# EAGLE schematic test1 (EAGLE 9.2.0)
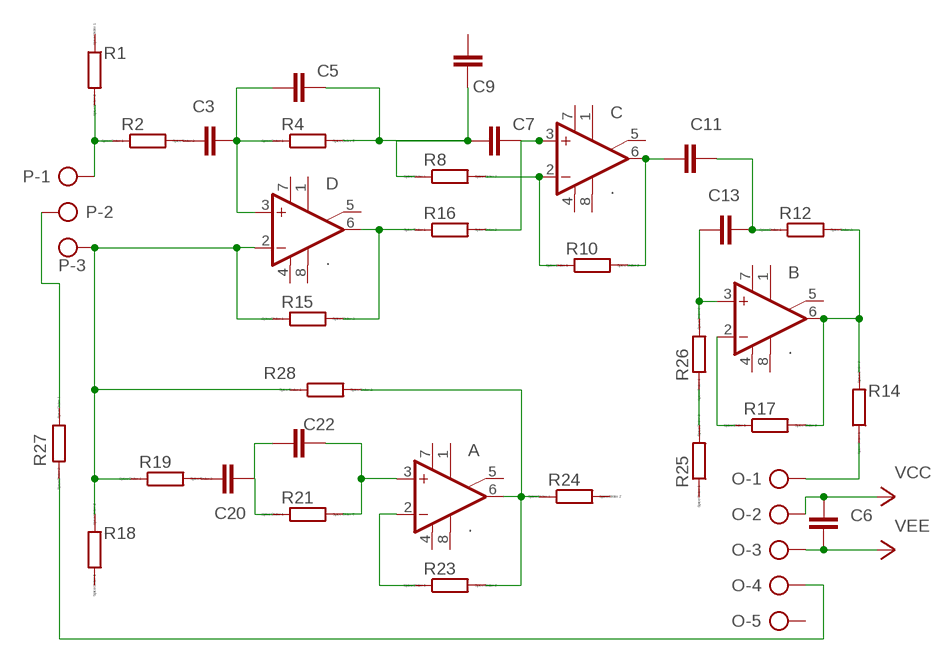
[diagram p0: schematic, sheet 1]

## Parts
A  .  TL071D  [SO08]
B  .  TL071D  [SO08]
C  .  TL071D  [SO08]
C3  C-EUC1210  [C1210]
C5  C-EUC1210  [C1210]
C6  C-EUC1210  [C1210]
C7  C-EUC1210  [C1210]
C9  C-EUC1210  [C1210]
C11  C-EUC1210  [C1210]
C13  C-EUC1210  [C1210]
C20  C-EUC1210  [C1210]
C22  C-EUC1210  [C1210]
D  .  TL071D  [SO08]
O  AK500/5-H  [AK500/5-H]
P  AK500/3-H  [AK500/3-H]
R1  RR1206  [R1206]
R2  RR1206  [R1206]
R4  RR1206  [R1206]
R8  RR1206  [R1206]
R10  RR1206  [R1206]
R12  RR1206  [R1206]
R14  RR1206  [R1206]
R15  RR1206  [R1206]
R16  RR1206  [R1206]
R17  RR1206  [R1206]
R18  RR1206  [R1206]
R19  RR1206  [R1206]
R21  RR1206  [R1206]
R23  RR1206  [R1206]
R24  RR1206  [R1206]
R25  RR1206  [R1206]
R26  RR1206  [R1206]
R27  RR1206  [R1206]
R28  RR1206  [R1206]

## Nets
N$1: P.1 R1.2 R2.1
N$2: C3.1 R2.2
N$3: C3.2 C5.1 D.3(+IN) R4.1
N$4: C11.2 C13.2 R12.1
N$5: O.1 R14.1
N$6: C7.2 C.3(+IN) R16.2
N$7: C5.2 C7.1 C9.1 R4.2 R8.1
N$8: C.2(-IN) R8.2 R10.1
N$9: C11.1 C.6(OUT) R10.2
N$10: B.3(+IN) C13.1 R26.2
N$11: B.6(OUT) R12.2 R14.2 R17.2
N$12: B.2(-IN) R17.1
N$13: D.6(OUT) R15.2 R16.1
N$14: D.2(-IN) P.3 R15.1 R18.2 R19.1 R28.1
N$15: C20.1 R19.2
N$16: C20.2 C22.1 R21.1
N$17: A.3(+IN) C22.2 R21.2
N$18: R25.2 R26.1
N$19: A.2(-IN) R23.1
N$20: A.6(OUT) R23.2 R24.1 R28.2
N$21: P.2 R27.1
N$22: O.4 R27.2
VCC: C6.1 C6.2 O.2 O.3 ; supply symbol labelled VEE
Unconnected: A.1(ON1) A.5(ON2) A.8(OPT) B.1(ON1) B.5(ON2) B.8(OPT) C9.2 C.1(ON1) C.5(ON2) C.8(OPT) D.1(ON1) D.5(ON2) D.8(OPT) O.5 R1.1 R18.1 R24.2 R25.1

## Power pins joined to a net without a drawn wire
V+: A.7(V+) B.7(V+) C.7(V+) D.7(V+)
V-: A.4(V-) B.4(V-) C.4(V-) D.4(V-)

## Library data of the parts
A B C D = linear:TL071: OP AMP
C3 C5-C7 C9 C11 C13 C20 C22 = rcl:C-EU: CAPACITOR, European symbol; SPICEPREFIX: C
O = con-ptr500:AK500/5-H: CONNECTOR Aug. 2004 / PTR Meßtechnik: Die Bezeichnung der Serie AK505 wurde geändert. Es handelt sich hierbei um AK500 in horizontaler Ausführung.; OC_FARNELL: unknown; OC_NEWARK: unknown
P = con-ptr500:AK500/3-H: CONNECTOR Aug. 2004 / PTR Meßtechnik: Die Bezeichnung der Serie AK505 wurde geändert. Es handelt sich hierbei um AK500 in horizontaler Ausführung.; OC_FARNELL: unknown; OC_NEWARK: unknown
R1 R2 R4 R8 R10 R12 R14-R19 R21 R23-R28 = eagle-ltspice:R: RESISTOR, European symbol; SPICEMODEL: NONE; SPICEPREFIX: R